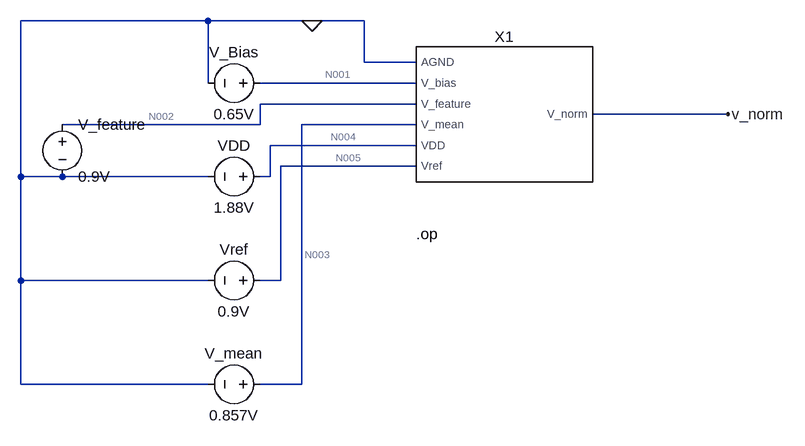
[diagram p0: schematic normalizer_test.asc]
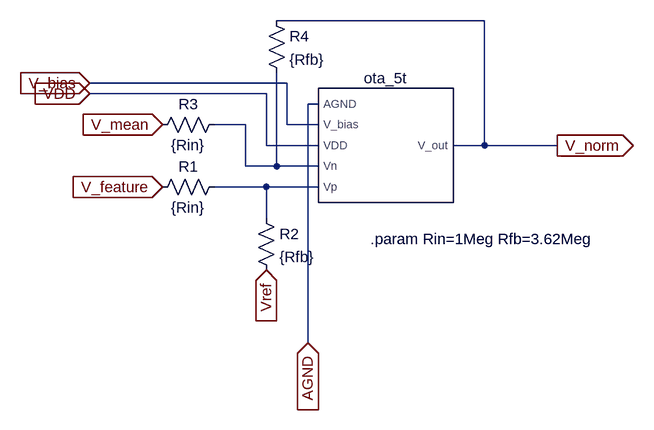
[diagram p1: sub-circuit normalizer.asc]
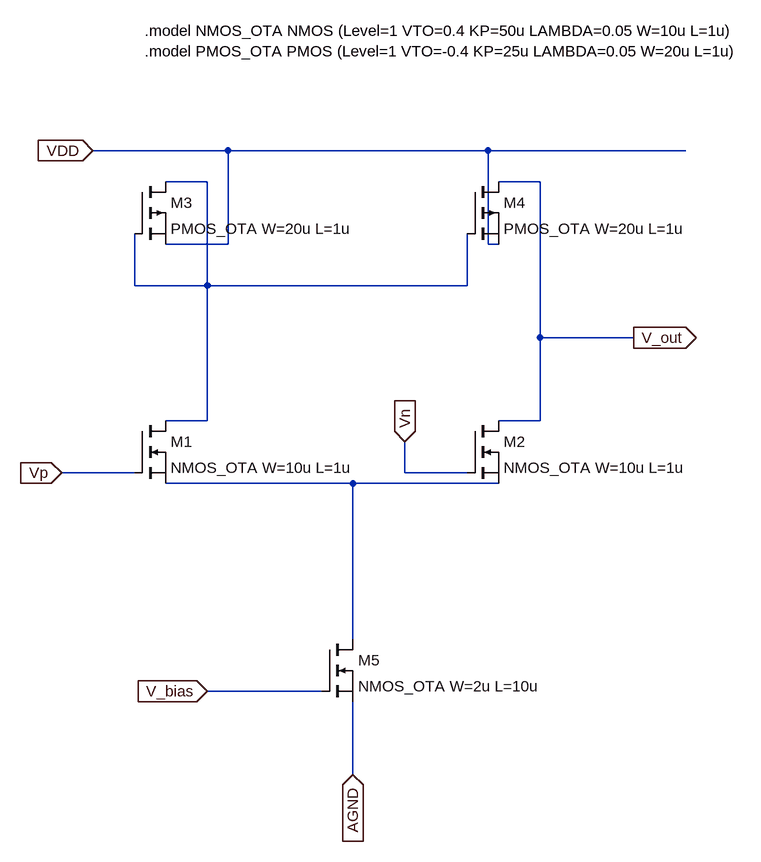
[diagram p2: sub-circuit ota_5t.asc]
normalizer_test.asc, the LTspice schematic file:
Version 4.1
SHEET 1 880 680
WIRE -256 16 -544 16
WIRE -96 16 -256 16
WIRE -16 16 -96 16
WIRE -16 80 -16 16
WIRE 64 80 -16 80
WIRE -256 112 -256 16
WIRE 64 112 -176 112
WIRE 64 144 -176 144
WIRE 544 160 336 160
WIRE -176 176 -176 144
WIRE -176 176 -480 176
WIRE 64 176 -112 176
WIRE 64 208 -160 208
WIRE 64 240 -144 240
WIRE -544 256 -544 16
WIRE -480 256 -544 256
WIRE -256 256 -480 256
WIRE -160 256 -160 208
WIRE -160 256 -176 256
WIRE -544 416 -544 256
WIRE -256 416 -544 416
WIRE -144 416 -144 240
WIRE -144 416 -176 416
WIRE -544 576 -544 416
WIRE -256 576 -544 576
WIRE -112 576 -112 176
WIRE -112 576 -176 576
FLAG -96 16 0
FLAG 544 160 v_norm
SYMBOL voltage -160 112 R90
WINDOW 0 -32 56 VBottom 2
WINDOW 3 32 56 VTop 2
SYMATTR InstName V_Bias
SYMATTR Value 0.65V
SYMBOL voltage -160 256 R90
WINDOW 0 -32 56 VBottom 2
WINDOW 3 32 56 VTop 2
SYMATTR InstName VDD
SYMATTR Value 1.88V
SYMBOL voltage -160 416 R90
WINDOW 0 -32 56 VBottom 2
WINDOW 3 32 56 VTop 2
SYMATTR InstName Vref
SYMATTR Value 0.9V
SYMBOL voltage -160 576 R90
WINDOW 0 -32 56 VBottom 2
WINDOW 3 32 56 VTop 2
SYMATTR InstName V_mean
SYMATTR Value 0.857V
SYMBOL voltage -480 160 R0
SYMATTR InstName V_feature
SYMATTR Value 0.9V
SYMBOL normalizer 192 160 R0
SYMATTR InstName X1
TEXT 64 344 Left 2 !.op

normalizer.asc, the sub-circuit schematic file:
Version 4.1
SHEET 1 880 680
WIRE 336 -32 16 -32
WIRE 32 64 -272 64
WIRE 0 80 -272 80
WIRE 80 96 64 96
WIRE -32 128 -80 128
WIRE 32 128 32 64
WIRE 80 128 32 128
WIRE 0 160 0 80
WIRE 80 160 0 160
WIRE 336 160 336 -32
WIRE 336 160 288 160
WIRE 448 160 336 160
WIRE -32 192 -32 128
WIRE 16 192 16 48
WIRE 16 192 -32 192
WIRE 80 192 16 192
WIRE 0 224 -80 224
WIRE 80 224 0 224
WIRE 0 272 0 224
WIRE 64 464 64 96
FLAG -272 80 VDD
IOPIN -272 80 In
FLAG 64 464 AGND
IOPIN 64 464 In
FLAG -272 64 V_bias
IOPIN -272 64 In
FLAG 448 160 V_norm
IOPIN 448 160 Out
FLAG -160 128 V_mean
IOPIN -160 128 In
FLAG 0 352 Vref
IOPIN 0 352 In
FLAG -160 224 V_feature
IOPIN -160 224 In
SYMBOL ota_5t 176 160 R0
SYMATTR InstName ota_5t
SYMBOL res -64 208 R90
WINDOW 0 0 56 VBottom 2
WINDOW 3 32 56 VTop 2
SYMATTR InstName R1
SYMATTR Value {Rin}
SYMBOL res -16 256 R0
SYMATTR InstName R2
SYMATTR Value {Rfb}
SYMBOL res -64 112 R90
WINDOW 0 0 56 VBottom 2
WINDOW 3 32 56 VTop 2
SYMATTR InstName R3
SYMATTR Value {Rin}
SYMBOL res 0 -48 R0
SYMATTR InstName R4
SYMATTR Value {Rfb}
TEXT 160 304 Left 2 !.param Rin=1Meg Rfb=3.62Meg

ota_5t.asc, the sub-circuit schematic file:
Version 4.1
SHEET 1 1004 736
WIRE 160 -352 -48 -352
WIRE 560 -352 160 -352
WIRE 864 -352 560 -352
WIRE 128 -304 64 -304
WIRE 640 -304 576 -304
WIRE 160 -208 160 -352
WIRE 160 -208 64 -208
WIRE 560 -208 560 -352
WIRE 576 -208 560 -208
WIRE 16 -144 16 -224
WIRE 128 -144 128 -304
WIRE 128 -144 16 -144
WIRE 528 -144 528 -224
WIRE 528 -144 128 -144
WIRE 640 -64 640 -304
WIRE 784 -64 640 -64
WIRE 128 64 128 -144
WIRE 128 64 64 64
WIRE 640 64 640 -64
WIRE 640 64 576 64
WIRE 16 144 -96 144
WIRE 432 144 432 96
WIRE 528 144 432 144
WIRE 352 160 64 160
WIRE 576 160 352 160
WIRE 352 400 352 160
WIRE 304 480 128 480
WIRE 352 608 352 496
FLAG -48 -352 VDD
IOPIN -48 -352 In
FLAG 352 608 AGND
IOPIN 352 608 In
FLAG -96 144 Vp
IOPIN -96 144 In
FLAG 432 96 Vn
IOPIN 432 96 In
FLAG 784 -64 V_out
IOPIN 784 -64 Out
FLAG 128 480 V_bias
IOPIN 128 480 In
SYMBOL nmos 16 64 R0
SYMATTR InstName M1
SYMATTR Value NMOS_OTA W=10u L=1u
SYMBOL nmos 528 64 R0
SYMATTR InstName M2
SYMATTR Value NMOS_OTA W=10u L=1u
SYMBOL pmos 16 -304 R0
SYMATTR InstName M3
SYMATTR Value PMOS_OTA W=20u L=1u
SYMBOL pmos 528 -304 R0
SYMATTR InstName M4
SYMATTR Value PMOS_OTA W=20u L=1u
SYMBOL nmos 304 400 R0
SYMATTR InstName M5
SYMATTR Value NMOS_OTA W=2u L=10u
TEXT 32 -536 Left 2 !.model NMOS_OTA NMOS (Level=1 VTO=0.4 KP=50u LAMBDA=0.05 W=10u L=1u)\n.model PMOS_OTA PMOS (Level=1 VTO=-0.4 KP=25u LAMBDA=0.05 W=20u L=1u)

The netlist it stands for:
* normalizer_test.asc
V_Bias N001 0 0.65V
VDD N004 0 1.88V
Vref N005 0 0.9V
V_mean N003 0 0.857V
V_feature N002 0 0.9V
X§X1 0 N001 N002 N003 N004 N005 v_norm normalizer

* block symbol definitions
.subckt normalizer AGND V_bias V_feature V_mean VDD Vref V_norm
X§ota_5t AGND V_bias VDD N001 N002 V_norm ota_5t
R1 N002 V_feature {Rin}
R2 N002 Vref {Rfb}
R3 N001 V_mean {Rin}
R4 V_norm N001 {Rfb}
.param Rin=1Meg Rfb=3.62Meg
.ends normalizer

.subckt ota_5t AGND V_bias VDD Vn Vp V_out
M1 N001 Vp N002 N002 NMOS_OTA W=10u L=1u
M2 V_out Vn N002 N002 NMOS_OTA W=10u L=1u
M3 N001 N001 VDD VDD PMOS_OTA W=20u L=1u
M4 V_out N001 VDD VDD PMOS_OTA W=20u L=1u
M5 N002 V_bias AGND AGND NMOS_OTA W=2u L=10u
.model NMOS_OTA NMOS (Level=1 VTO=0.4 KP=50u LAMBDA=0.05 W=10u L=1u)
.model PMOS_OTA PMOS (Level=1 VTO=-0.4 KP=25u LAMBDA=0.05 W=20u L=1u)
.ends ota_5t

.model NMOS NMOS
.model PMOS PMOS
.lib standard.mos
.op
.backanno
.end

* Results of the author's LTspice run, read from the files saved beside the schematic
* Operating Point:
*   V(n001) = 650 mV
*   V(n002) = 900 mV
*   V(n003) = 857 mV
*   V(n004) = 1.88 V
*   V(n005) = 900 mV
*   V(v_norm) = 1.044 V
*   I(VDD) = -360.3 nA
*   I(V_Bias) = 0 A
*   I(V_feature) = 0 A
*   I(V_mean) = 40.38 nA
*   I(Vref) = 0 A
*   Ix(x1:agnd) = -319.9 nA
*   Ix(x1:v_bias) = 0 A
*   Ix(x1:v_feature) = 0 A
*   Ix(x1:v_mean) = -40.38 nA
*   Ix(x1:v_norm) = 0 A
*   Ix(x1:vdd) = 360.3 nA
*   Ix(x1:vref) = 0 A